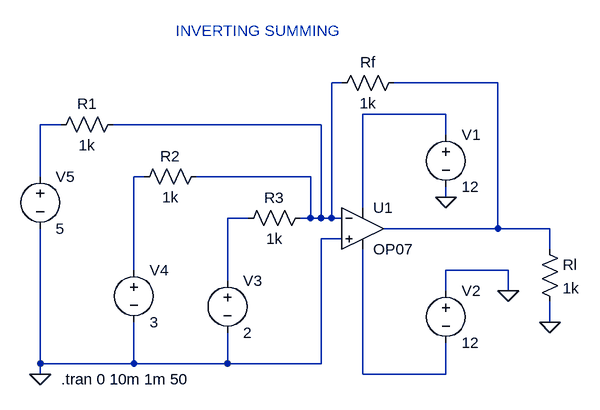
[diagram p0: schematic Inverting Summing.asc]
Inverting Summing.asc, the LTspice schematic file:
Version 4
SHEET 1 880 680
WIRE 80 -112 64 -112
WIRE 320 -112 160 -112
WIRE 240 -64 112 -64
WIRE -352 -48 -384 -48
WIRE 48 -48 -272 -48
WIRE 240 -32 240 -64
WIRE -384 32 -384 -48
WIRE -224 32 -240 32
WIRE 32 32 -144 32
WIRE 240 64 240 48
WIRE 112 80 112 -64
WIRE -64 96 -96 96
WIRE 32 96 32 32
WIRE 32 96 16 96
WIRE 48 96 48 -48
WIRE 48 96 32 96
WIRE 64 96 64 -112
WIRE 64 96 48 96
WIRE 80 96 64 96
WIRE 320 112 320 -112
WIRE 320 112 144 112
WIRE 400 112 320 112
WIRE 80 128 48 128
WIRE 400 144 400 112
WIRE -240 176 -240 32
WIRE 336 176 240 176
WIRE -96 192 -96 96
WIRE 240 208 240 176
WIRE 336 208 336 176
WIRE 400 256 400 224
WIRE -384 320 -384 112
WIRE -240 320 -240 256
WIRE -240 320 -384 320
WIRE -96 320 -96 272
WIRE -96 320 -240 320
WIRE 48 320 48 128
WIRE 48 320 -96 320
WIRE -384 336 -384 320
WIRE 112 336 112 144
WIRE 240 336 240 288
WIRE 240 336 112 336
FLAG 240 64 0
FLAG 400 256 0
FLAG 336 208 0
FLAG -384 336 0
SYMBOL OpAmps\\OP07 112 48 R0
SYMATTR InstName U1
SYMBOL voltage 240 -48 R0
SYMATTR InstName V1
SYMATTR Value 12
SYMBOL voltage 240 192 R0
SYMATTR InstName V2
SYMATTR Value 12
SYMBOL voltage -96 176 R0
SYMATTR InstName V3
SYMATTR Value 2
SYMBOL voltage -240 160 R0
WINDOW 123 0 0 Left 0
WINDOW 39 0 0 Left 0
SYMATTR InstName V4
SYMATTR Value 3
SYMBOL voltage -384 16 R0
SYMATTR InstName V5
SYMATTR Value 5
SYMBOL res -256 -64 R90
WINDOW 0 0 56 VBottom 2
WINDOW 3 32 56 VTop 2
SYMATTR InstName R1
SYMATTR Value 1k
SYMBOL res -240 48 R270
WINDOW 0 32 56 VTop 2
WINDOW 3 0 56 VBottom 2
SYMATTR InstName R2
SYMATTR Value 1k
SYMBOL res -80 112 R270
WINDOW 0 32 56 VTop 2
WINDOW 3 0 56 VBottom 2
SYMATTR InstName R3
SYMATTR Value 1k
SYMBOL res 176 -128 R90
WINDOW 0 0 56 VBottom 2
WINDOW 3 32 56 VTop 2
SYMATTR InstName Rf
SYMATTR Value 1k
SYMBOL res 384 128 R0
SYMATTR InstName Rl
SYMATTR Value 1k
TEXT -176 -192 Left 2 ;INVERTING SUMMING
TEXT -352 344 Left 2 !.tran 0 10m 1m 50

The netlist it stands for:
* Inverting Summing.asc
XU1 0 N001 N003 N007 N002 LT1001  ; OP07, pins In+ In- V+ V- OUT
V1 N003 0 12
V2 0 N007 12
V3 N006 0 2
V4 N005 0 3
V5 N004 0 5
R1 N001 N004 1k
R2 N005 N001 1k
R3 N006 N001 1k
Rf N002 N001 1k
Rl N002 0 1k
* INVERTING SUMMING
.tran 0 10m 1m 50
.lib LTC.lib
.backanno
.end